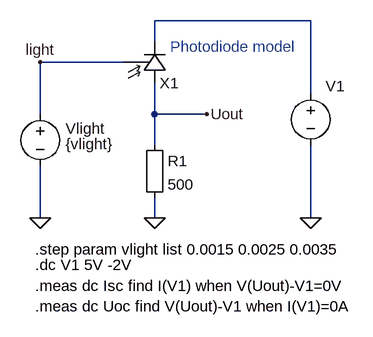
[diagram p0: schematic PHOTO-DC-5.asc]
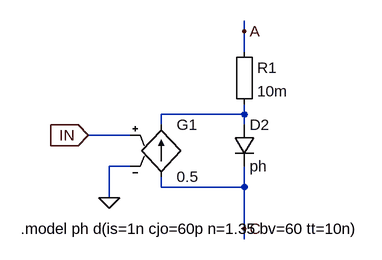
[diagram p1: sub-circuit photodiode.asc]
PHOTO-DC-5.asc, the LTspice schematic file:
Version 4
SHEET 1 880 680
WIRE 176 16 -64 16
WIRE -64 48 -64 16
WIRE -112 80 -240 80
WIRE 176 128 176 16
WIRE -240 160 -240 80
WIRE -64 160 -64 112
WIRE 16 160 -64 160
WIRE -64 208 -64 160
WIRE -240 320 -240 240
WIRE -64 320 -64 288
WIRE 176 320 176 208
FLAG -240 320 0
FLAG 176 320 0
FLAG -64 320 0
FLAG 16 160 Uout
FLAG -240 80 light
SYMBOL voltage -240 144 R0
WINDOW 0 39 38 Left 2
WINDOW 3 39 62 Left 2
WINDOW 123 0 0 Left 2
WINDOW 39 39 82 Left 2
SYMATTR InstName Vlight
SYMATTR Value {vlight}
SYMBOL photodiode -80 112 M180
SYMATTR InstName X1
SYMBOL voltage 176 112 R0
WINDOW 3 24 32 Invisible 2
WINDOW 123 0 0 Left 2
WINDOW 39 23 25 Left 2
WINDOW 0 23 5 Left 2
SYMATTR Value 0
SYMATTR InstName V1
SYMBOL Misc\\EuropeanResistor -80 192 R0
SYMATTR InstName R1
SYMATTR Value 500
TEXT -248 392 Left 2 !.dc V1 5V -2V
TEXT -248 368 Left 2 !.step param vlight list 0.0015 0.0025 0.0035
TEXT -248 424 Left 2 !.meas dc Isc find I(V1) when V(Uout)-V1=0V
TEXT -248 456 Left 2 !.meas dc Uoc find V(Uout)-V1 when I(V1)=0A
TEXT -40 56 Left 2 ;Photodiode model

photodiode.asc, the sub-circuit schematic file:
Version 4
SHEET 1 880 680
WIRE 80 32 80 16
WIRE 80 64 80 32
WIRE 80 160 80 144
WIRE 80 160 -48 160
WIRE -48 176 -48 160
WIRE 80 176 80 160
WIRE -96 192 -160 192
WIRE -96 240 -128 240
WIRE -48 272 -48 256
WIRE 80 272 80 240
WIRE 80 272 -48 272
WIRE -128 288 -128 240
WIRE 80 336 80 272
WIRE 80 352 80 336
FLAG -128 288 0
FLAG 80 32 A
FLAG 80 336 C
FLAG -160 192 IN
IOPIN -160 192 In
SYMBOL Misc\\EuropeanResistor 64 48 R0
SYMATTR InstName R1
SYMATTR Value 10m
SYMBOL g -48 160 R0
SYMATTR InstName G1
SYMATTR Value 0.5
SYMBOL diode 64 176 R0
SYMATTR InstName D2
SYMATTR Value ph
TEXT -264 336 Left 2 !.model ph d(is=1n cjo=60p n=1.35 bv=60 tt=10n)

The netlist it stands for:
* PHOTO-DC-5.asc
Vlight light 0 {vlight}
XX1 Uout N001 light photodiode
V1 N001 0 0
R1 Uout 0 500

* block symbol definitions
.subckt photodiode A C IN
R1 A N001 10m
G1 C N001 IN 0 0.5
D2 N001 C ph
.model ph d(is=1n cjo=60p n=1.35 bv=60 tt=10n)
.ends photodiode

.model D D
.lib standard.dio
.dc V1 5V -2V
.step param vlight list 0.0015 0.0025 0.0035
.meas dc Isc find I(V1) when V(Uout)-V1=0V
.meas dc Uoc find V(Uout)-V1 when I(V1)=0A
* Photodiode model
.backanno
.end